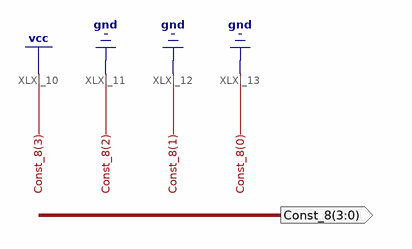
[diagram p0: schematic sheet 1]
// Xilinx ISE schematic Const_8.sch (spartan6) as structural Verilog: 0 symbols, 1 ports
module Const_8 (
  output [3:0] Const_8
);


  assign Const_8 = 4'b1000;
endmodule
